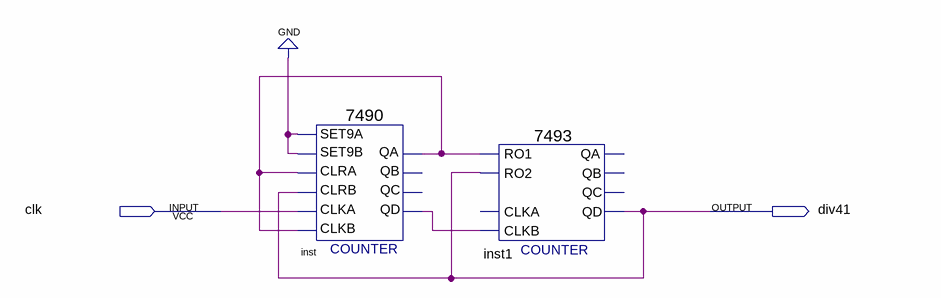
[diagram p0: schematic sheet]
// Quartus schematic div_41.bdf as structural Verilog: 2 symbols, 2 pins
module div_41 (
  input  clk,
  output div41
);

  wire inst_qa, inst_qd;

  \7490  inst (
    .SET9A(1'b0), .CLRA(inst_qa), .SET9B(1'b0), .CLKB(inst_qa), .CLKA(clk), .CLRB(div41), .QD(inst_qd),
    .QA(inst_qa));  // open: QB, QC
  \7493  inst1 (.RO1(inst_qa), .RO2(div41), .CLKB(inst_qd), .QD(div41));  // open: CLKA, QC, QB, QA
endmodule
